# EAGLE design modular pcb2 (EAGLE 9.6.2)
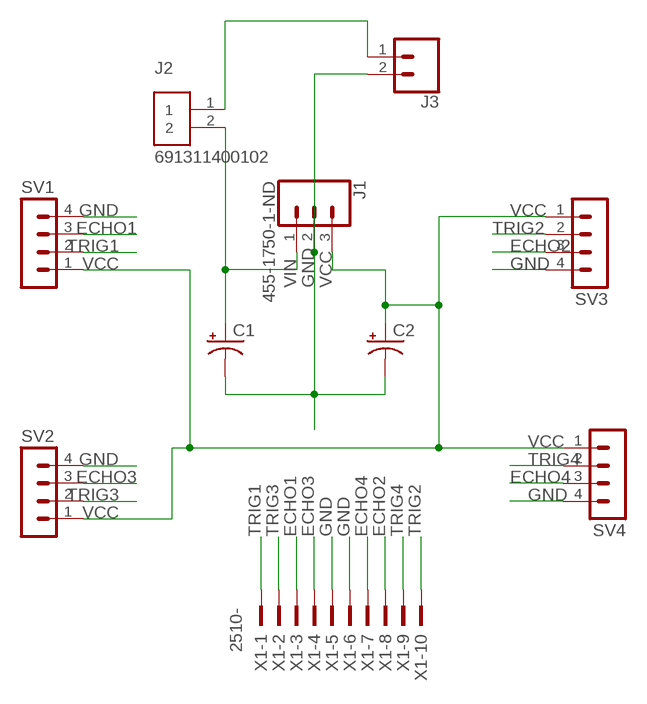
[diagram p0: schematic, sheet 1]

## Parts
C1  1F-2.7V(PTH)CPOL-RADIAL-1H-2.7V  [CPOL-RADIAL-1F-2.7V]
C2  1F-2.7V(PTH)CPOL-RADIAL-1H-2.7V  [CPOL-RADIAL-1F-2.7V]
J1  455-1750-1-ND  CONN_03  [1X03]
J2  691311400102  [TERMINALBLOCK_PLUGGABLE-2-7.62MM]
J3  CONN_02  [1X02]
SV1  MA04-1  [MA04-1]
SV2  MA04-1  [MA04-1]
SV3  MA04-1  [MA04-1]
SV4  MA04-1  [MA04-1]
X1  2510-  [PAK100/2500-10]

## Nets
ECHO1: SV1.3 X1.3
ECHO2: SV3.3 X1.8
ECHO3: SV2.3 X1.4
ECHO4: SV4.3 X1.7
GND: C1.- C2.- J1.2 J3.2 SV1.4 SV2.4 SV3.4 SV4.4 X1.5 X1.6
N$1: J2.1 J3.1
TRIG1: SV1.2 X1.1
TRIG2: SV3.2 X1.10
TRIG3: SV2.2 X1.2
TRIG4: SV4.2 X1.9
VCC: C2.+ J1.3 SV1.1 SV2.1 SV3.1 SV4.1
VIN: C1.+ J1.1 J2.2

## Library data of the parts
C1 C2 = SparkFun-Capacitors:1F-2.7V(PTH): 1F 2.7V SuperCapacitor CAP-14696; PROD_ID: CAP-14696
J1 = SparkFun-Connectors:CONN_03: Multi connection point. Often used as Generic Header-pin footprint for 0.1 inch spaced/style header connections On any of the 0.1 inch spaced packages, you can populate with these: Break Away Headers - Straight <https://www.sparkfun.com/products/116> (PRT-00116) Break Away Male Headers - Right Angle <https://www.sparkfun.com/products/553> (PRT-00553) Female Headers <https://www.sparkfun.com/products/115> (PRT-00115) Break Away Headers - Machine Pin <https://www.sparkfun.com/products/117> (PRT-00117) Break Away Female Headers - Swiss Machine Pin <https://www.sparkfun.com/products/743> (PRT-00743) Stackable Header - 3 Pin (Female, 0.1") <https://www.sparkfun.com/products/13875> (PRT-13875) For SCREWTERMINALS and SPRING TERMINALS visit here: Screw Terimnals on SparkFun.com <https://www.sparkfun.com/search/results?term=Screw+Terminals> (5mm/3.5mm/2.54mm spacing) This device is also useful as a general connection point to wire up your design to another part of your project. Our various solder wires solder well into these plated through hole pads. Hook-Up Wire - Assortment (Stranded, 22 AWG) <https://www.sparkfun.com/products/11375> (PRT-11375) Hook-Up Wire - Assortment (Solid Core, 22 AWG) <https://www.sparkfun.com/products/11367> (PRT-11367) View the entire wire category on our website here <https://www.sparkfun.com/categories/141> Special notes: Molex polarized connector foot print use with SKU : PRT-08232 with associated crimp pins and housings.; PROD_ID: XXX-00000
J2 = Terminal Blocks FOR USE IN PB:691311400102: 7.62MM CLOSE VERTICAL PCB HEADER WR-TBL Manufacturer's datasheet <https://katalog.we-online.com/em/datasheet/6913114001xx.pdf>; CREATED_BY: PCBLayout.com; DIGIKEY_PART_NO: 732-2823-ND; MANUFACTURER: WURTH ELEKTRONIK; MPN: 691311400102
J3 = SparkFun-Connectors:CONN_02: Multi connection point. Often used as Generic Header-pin footprint for 0.1 inch spaced/style header connections On any of the 0.1 inch spaced packages, you can populate with these: Break Away Headers - Straight <https://www.sparkfun.com/products/116> (PRT-00116) Break Away Male Headers - Right Angle <https://www.sparkfun.com/products/553> (PRT-00553) Female Headers <https://www.sparkfun.com/products/115> (PRT-00115) Break Away Headers - Machine Pin <https://www.sparkfun.com/products/117> (PRT-00117) Break Away Female Headers - Swiss Machine Pin <https://www.sparkfun.com/products/743> (PRT-00743) For SCREWTERMINALS and SPRING TERMINALS visit here: Screw Terimnals on SparkFun.com <https://www.sparkfun.com/search/results?term=Screw+Terminals> (5mm/3.5mm/2.54mm spacing) This device is also useful as a general connection point to wire up your design to another part of your project. Our various solder wires solder well into these plated through hole pads. Hook-Up Wire - Assortment (Stranded, 22 AWG) <https://www.sparkfun.com/products/11375> (PRT-11375) Hook-Up Wire - Assortment (Solid Core, 22 AWG) <https://www.sparkfun.com/products/11367> (PRT-11367) View the entire wire category on our website here <https://www.sparkfun.com/categories/141> Special notes: Molex polarized connector foot print use with: PRT-08233 with associated crimp pins and housings. 2.54_SCREWTERM for use with PRT-10571. 3.5mm Screw Terminal footprints for PRT-08084 5mm Screw Terminal footprints for use with PRT-08432
SV1-SV4 = con-lstb:MA04-1: PIN HEADER; OC_FARNELL: unknown; OC_NEWARK: unknown
X1 = con-3m:2510-: 3M (TM) Pak 100 4-Wall Header Source: 3M; MF: 3M; MPN: 2510-6002UB; OC_FARNELL: 9838244; OC_NEWARK: 46F4725

## Board
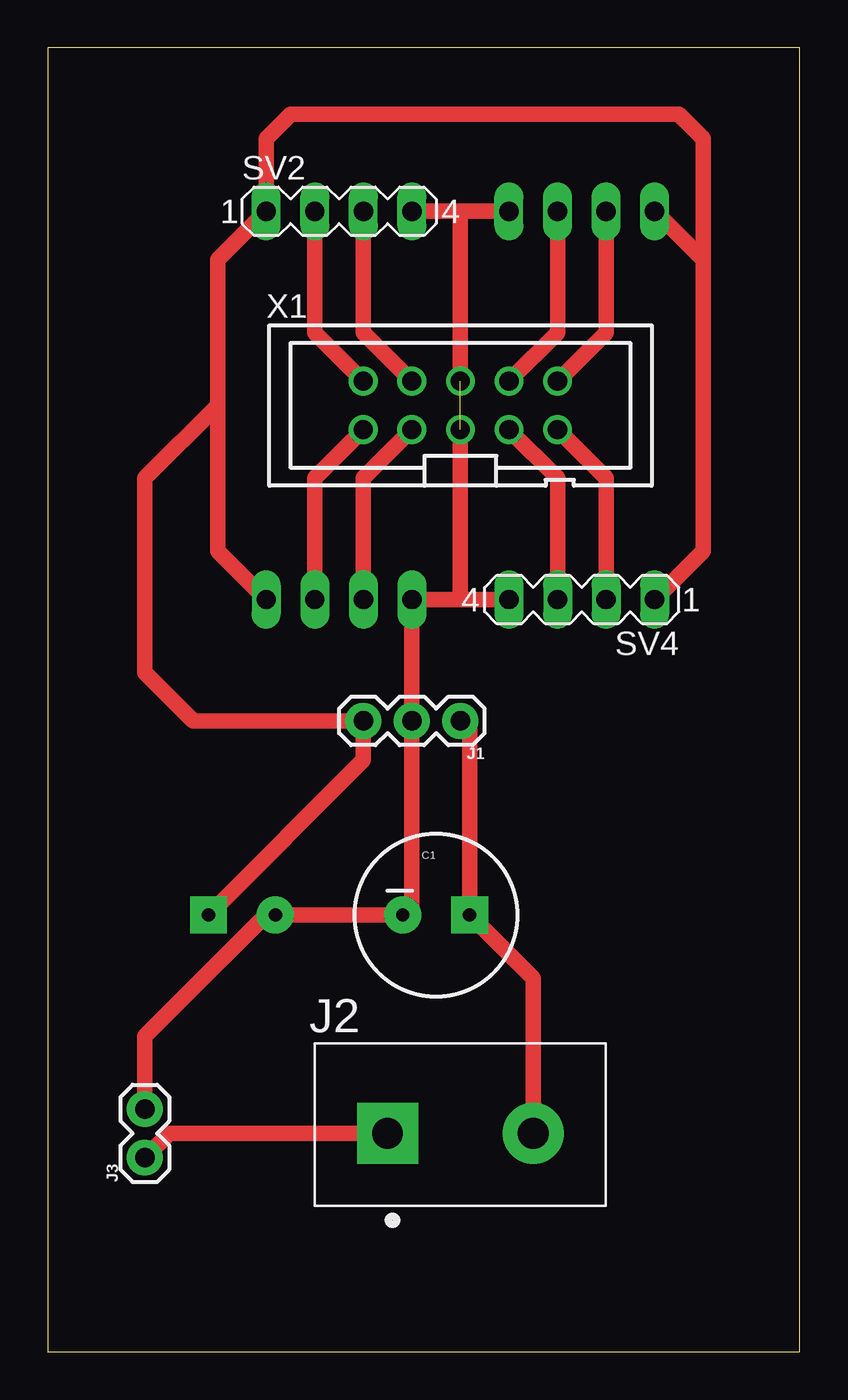
[diagram p1: board, top side]
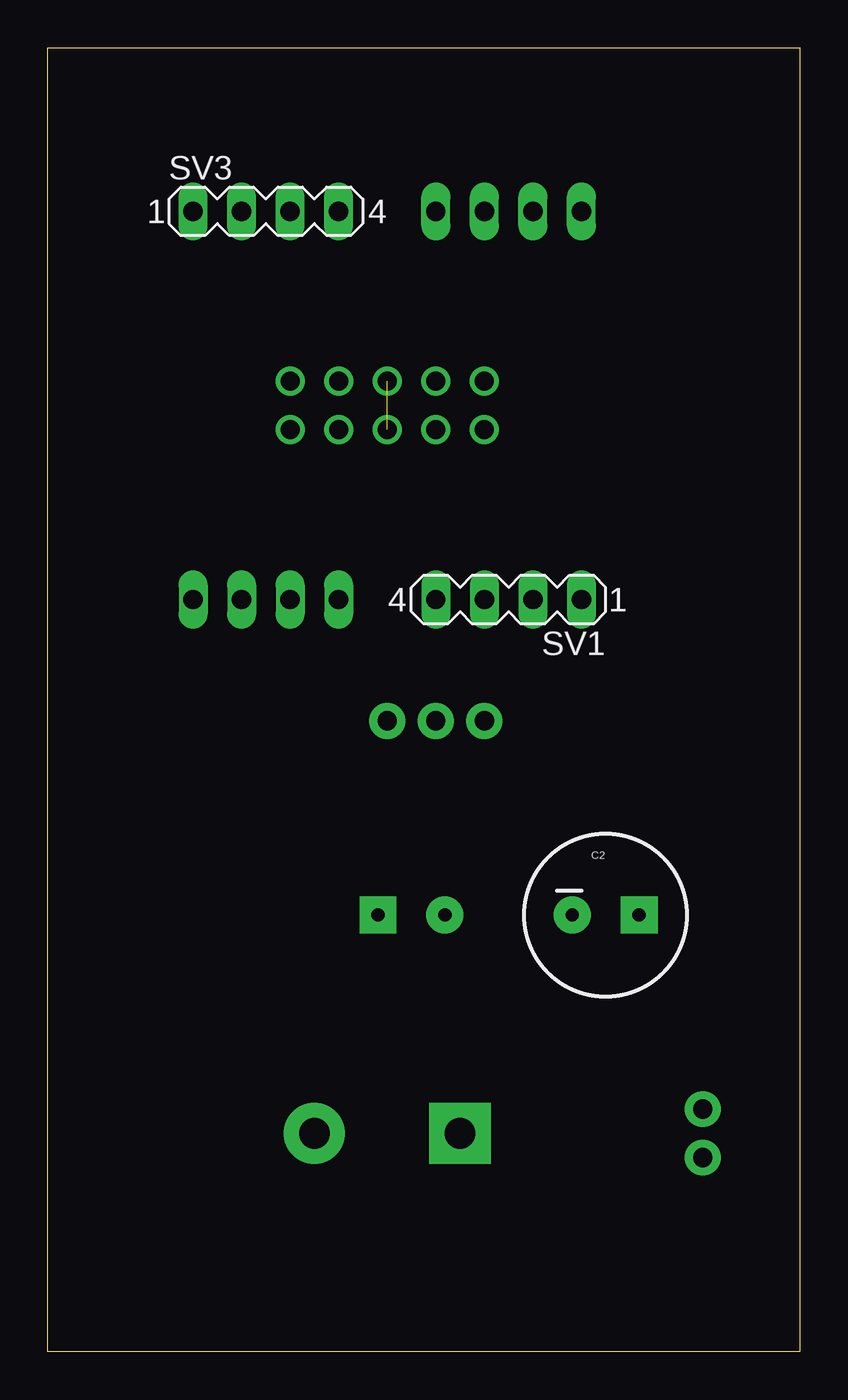
[diagram p2: board, bottom side, seen from below]

Size 39.35 x 68.25 mm. Coordinates in mm from the lower left corner, seen from the top.
Outline: 0,0 39.35,0 39.35,68.25 0,68.25 0,0
Copper layers (1*16): Top 0.035mm / dielectric 1.5mm / Bottom 0.035mm
Design rules "default": minimum track width 6mil, minimum drill 0.35mm, track to track 6mil, track to pad 6mil, pad to pad 6mil, via to via 6mil, smd to smd 6mil, copper to edge 40mil, drill to drill 6mil, minimum pad ring 10mil, minimum via ring 8mil, stop-mask expansion 4mil, vias tented up to drill 0mil, thermal gap 10mil

### Footprints (pad centres in the part's own frame; a part is rotated, then mirrored left to right if it is on the bottom)
CPOL-RADIAL-1F-2.7V = drill 0.7 pad 1.93 square: + 1.75,0 | drill 0.7 pad 1.93: - -1.75,0
1X03 = drill 1.016 pad 1.88: 1 0,0; 2 2.54,0; 3 5.08,0
TERMINALBLOCK_PLUGGABLE-2-7.62MM = drill 1.6 pad 3.2 square: 1 -3.81,0 | drill 1.6 pad 3.2: 2 3.81,0
1X02 = drill 1.016 pad 1.88: 1 0,0; 2 2.54,0
MA04-1 = drill 1.016 long: 1 -3.81,0; 2 -1.27,0; 3 1.27,0; 4 3.81,0
PAK100/2500-10 = drill 1 pad 1.422: 1 -5.08,-1.27; 2 -5.08,1.27; 3 -2.54,-1.27; 4 -2.54,1.27; 5 0,-1.27; 6 0,1.27; 7 2.54,-1.27; 8 2.54,1.27; 9 5.08,-1.27; 10 5.08,1.27

### Placement (x,y rotation side)
C1  20.32,22.86 0 top
C2  10.16,22.86 0 bottom
J1  21.59,33.02 180 top
J2  21.59,11.43 0 top
J3  5.08,10.16 90 top
SV1  15.24,39.37 180 bottom
SV2  15.24,59.69 0 top
SV3  27.94,59.69 0 bottom
SV4  27.94,39.37 180 top
X1  21.59,49.53 0 top

### Tracks (layer width: path | path; a pad name or v marks a point on that pad's centre or on a via)
ECHO1
  Top 0.813: X1.3 16.51,45.72 SV1.3
ECHO2
  Top 0.813: X1.8 26.67,53.34 SV3.3
ECHO3
  Top 0.813: X1.4 16.51,53.34 SV2.3
ECHO4
  Top 0.813: X1.7 26.67,45.72 SV4.3
GND  (1 unrouted)
  Top 0.813: SV2.4 21.59,59.69 | 21.59,59.69 SV3.4 | 21.59,39.37 SV1.4 J1.2 19.05,23.34 C1.- C2.- 11.43,22.86 5.08,16.51 J3.2 | 21.59,39.37 SV4.4 | X1.5 21.59,39.37 | 21.59,59.69 X1.6
N$1
  Top 0.813: J3.1 6.35,11.43 J2.1
TRIG1
  Top 0.813: X1.1 13.97,45.72 SV1.2
TRIG2
  Top 0.813: SV3.2 29.21,53.34 X1.10
TRIG3
  Top 0.813: X1.2 13.97,53.34 SV2.2
TRIG4
  Top 0.813: X1.9 29.21,45.72 SV4.2
VCC
  Top 0.813: 8.89,49.53 8.89,57.15 SV2.1 11.43,63.5 12.7,64.77 33.02,64.77 34.29,63.5 34.29,57.15 | 8.89,49.53 8.89,41.91 SV1.1 | SV3.1 34.29,57.15 | SV4.1 34.29,41.91 34.29,57.15 | 8.89,49.53 5.08,45.72 5.08,35.56 7.62,33.02 J1.3 16.51,30.96 C2.+
VIN
  Top 0.813: J1.1 22.07,32.54 C1.+ 25.4,19.53 J2.2